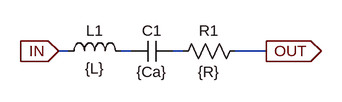
[diagram p0: schematic capacitor.asc]
capacitor.asc, the LTspice schematic file:
Version 4
SHEET 1 880 680
WIRE 64 176 48 176
WIRE 160 176 144 176
WIRE 240 176 224 176
WIRE 368 176 320 176
FLAG 48 176 IN
IOPIN 48 176 In
FLAG 368 176 OUT
IOPIN 368 176 Out
SYMBOL ind 48 192 R270
WINDOW 0 32 56 VTop 2
WINDOW 3 5 56 VBottom 2
SYMATTR InstName L1
SYMATTR Value {L}
SYMBOL cap 160 192 R270
WINDOW 0 32 32 VTop 2
WINDOW 3 0 32 VBottom 2
SYMATTR InstName C1
SYMATTR Value {Ca}
SYMBOL res 336 160 R90
WINDOW 0 0 56 VBottom 2
WINDOW 3 32 56 VTop 2
SYMATTR InstName R1
SYMATTR Value {R}

The netlist it stands for:
* capacitor.asc
L1 IN N001 {L}
C1 N001 N002 {Ca}
R1 OUT N002 {R}
.backanno
.end